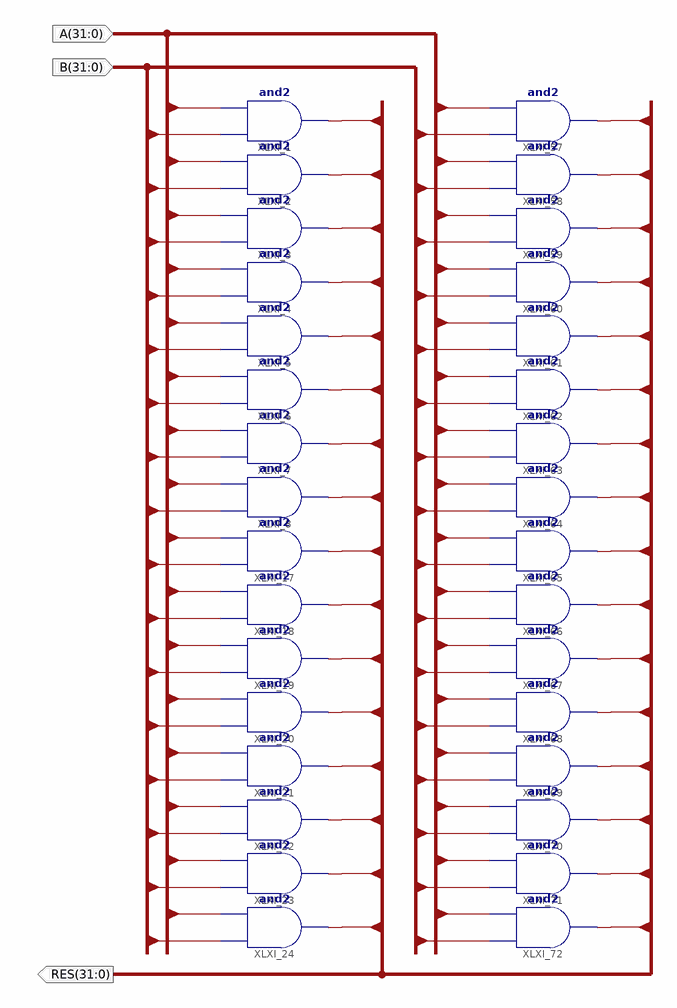
[diagram p0: schematic sheet 1]
// Xilinx ISE schematic op_and32bit.sch (spartan3e) as structural Verilog: 32 symbols, 3 ports
module op_and32bit (
  input  [31:0] A,
  input  [31:0] B,
  output [31:0] RES
);

  and XLXI_1 (RES[31], B[31], A[31]);
  and XLXI_2 (RES[30], B[30], A[30]);
  and XLXI_3 (RES[29], B[29], A[29]);
  and XLXI_4 (RES[28], B[28], A[28]);
  and XLXI_5 (RES[27], B[27], A[27]);
  and XLXI_7 (RES[25], B[25], A[25]);
  and XLXI_8 (RES[24], B[24], A[24]);
  and XLXI_17 (RES[23], B[23], A[23]);
  and XLXI_18 (RES[22], B[22], A[22]);
  and XLXI_19 (RES[21], B[21], A[21]);
  and XLXI_20 (RES[20], B[20], A[20]);
  and XLXI_21 (RES[19], B[19], A[19]);
  and XLXI_22 (RES[18], B[18], A[18]);
  and XLXI_23 (RES[17], B[17], A[17]);
  and XLXI_24 (RES[16], B[16], A[16]);
  and XLXI_57 (RES[15], B[15], A[15]);
  and XLXI_59 (RES[13], B[13], A[13]);
  and XLXI_60 (RES[12], B[12], A[12]);
  and XLXI_61 (RES[11], B[11], A[11]);
  and XLXI_62 (RES[10], B[10], A[10]);
  and XLXI_63 (RES[9], B[9], A[9]);
  and XLXI_64 (RES[8], B[8], A[8]);
  and XLXI_65 (RES[7], B[7], A[7]);
  and XLXI_66 (RES[6], B[6], A[6]);
  and XLXI_67 (RES[5], B[5], A[5]);
  and XLXI_68 (RES[4], B[4], A[4]);
  and XLXI_69 (RES[3], B[3], A[3]);
  and XLXI_70 (RES[2], B[2], A[2]);
  and XLXI_71 (RES[1], B[1], A[1]);
  and XLXI_72 (RES[0], B[0], A[0]);
  and XLXI_6 (RES[26], B[26], A[26]);
  and XLXI_58 (RES[14], B[14], A[14]);
endmodule
